# Altium schematic sheet 2021.SchDoc
size A4
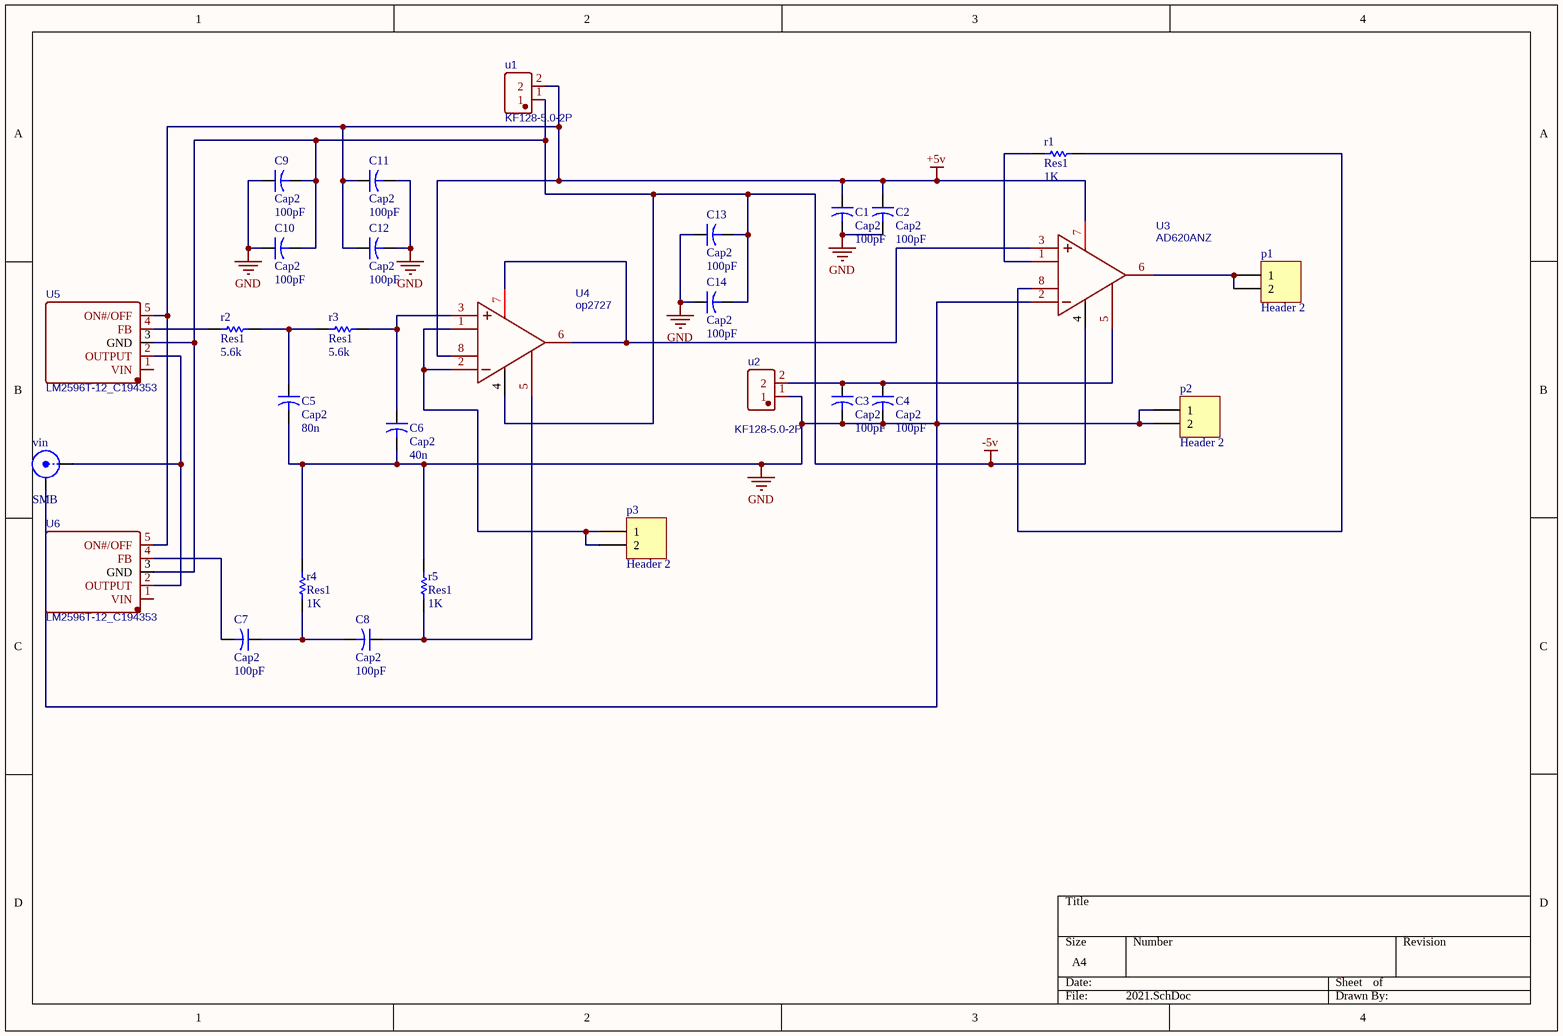
[diagram p0: 2021.SchDoc]

## Parts
C1  Cap2  value 100pF  [CAPR5-4X5]
C2  Cap2  value 100pF  [CAPR5-4X5]
C3  Cap2  value 100pF  [CAPR5-4X5]
C4  Cap2  value 100pF  [CAPR5-4X5]
C5  Cap2  value 80n  [CAPR5-4X5]
C6  Cap2  value 40n  [CAPR5-4X5]
C7  Cap2  value 100pF  [CAPR5-4X5]
C8  Cap2  value 100pF  [CAPR5-4X5]
C9  Cap2  value 100pF  [CAPR5-4X5]
C10  Cap2  value 100pF  [CAPR5-4X5]
C11  Cap2  value 100pF  [CAPR5-4X5]
C12  Cap2  value 100pF  [CAPR5-4X5]
C13  Cap2  value 100pF  [CAPR5-4X5]
C14  Cap2  value 100pF  [CAPR5-4X5]
p1  Header 2  [HDR1X2]
p2  Header 2  [HDR1X2]
p3  Header 2  [HDR1X2]
r1  Res1  value 1K  [AXIAL-0.3]
r2  Res1  value 5.6k  [AXIAL-0.3]
r3  Res1  value 5.6k  [AXIAL-0.3]
r4  Res1  value 1K  [AXIAL-0.3]
r5  Res1  value 1K  [AXIAL-0.3]
u1  KF128-5.0-2P  [CONN-TH_P5.00_KF128-5.0-2P]
u2  KF128-5.0-2P  [CONN-TH_P5.00_KF128-5.0-2P]
U3  AD620ANZ  [DIP-8_L9.3-W6.4-P2.54-LS7.6-BL]
U4  op2727  [DIP-8_L9.3-W6.4-P2.54-LS7.6-BL]
U5  LM2596T-12_C194353  [TO-220-5L_L10.2-W4.5-P1.71-L]
U6  LM2596T-12_C194353  [TO-220-5L_L10.2-W4.5-P1.71-L]
vin  SMB  [SMB_V-RJ45]

## Nets
+5v: C1.1 C2.1 C11.1 C12.1 u1.2 U3.7(+VS) U4.8(RG) U5.5(ON#/OFF) U6.5(ON#/OFF)
-5v: C9.2 C10.2 C13.2 C14.2 u1.1 U3.4(-VS) U4.4(-VS) U5.3(GND) U6.3(GND)
GND: C1.2 C2.2 C3.2 C4.2 C5.2 C6.2 C9.1 C10.1 C11.2 C12.2 C13.1 C14.1 p2.1 p2.2 r4.2 r5.2 u2.1 U3.2(-IN) vin.2(Y)
NetC3_1: C3.1 C4.1 u2.2 U3.5(REF)
NetC5_1: C5.1 r2.2 r3.1
NetC6_1: C6.1 r3.2 U4.3(+IN)
NetC7_1: C7.1 C8.2 r4.1
NetC7_2: C7.2 U6.4(FB)
NetC8_1: C8.1 r5.1 U4.5(REF)
Netp1_1: p1.1 p1.2 U3.6(OUTPUT)
Netp3_1: p3.1 p3.2 U4.1(RG) U4.2(-IN)
Netr1_1: r1.1 U3.1(RG)
Netr1_2: r1.2 U3.8(RG)
Netr2_1: r2.1 U5.4(FB)
NetU3_3: U3.3(+IN) U4.6(OUTPUT) U4.7(+VS)
NetU5_2: U5.2(OUTPUT) U6.2(OUTPUT) vin.1(X)

Not connected (* = marked no-connect by the designer): U5 1(VIN); U6 1(VIN)

## Library data of the parts
C1-C14 = Cap2: Capacitor; Published: 23-Sep-2002; PackageReference: CAPR5-4X5; Publisher: Altium Limited
p1-p3 = Header 2: Header, 2-Pin; LatestRevisionDate: 17-Jul-2002; LatestRevisionNote: Re-released for DXP Platform.; Publisher: Altium Limited
r1-r5 = Res1: Resistor; Published: 8-Jun-2000; LatestRevisionDate: 17-Jul-2002; LatestRevisionNote: Re-released for DXP Platform.; PackageReference: AXIAL-0.3; Publisher: Altium Limited
u1 u2 = KF128-5.0-2P: BOM_Manufacturer: Cixi Kefa Elec; Contributor: LCSC; BOM_Supplier: LCSC; BOM_Supplier Part: C474950; BOM_Manufacturer Part: KF128-5.0-2P; BOM_JLCPCB Part Class: Extended Part; spicePre: U; spiceSymbolName: KF128-5.0-2P
U3 U4 = AD620ANZ: BOM_Manufacturer: ADI; spicePre: X; BOM_Supplier: LCSC; BOM_Manufacturer Part: AD620ANZ; BOM_Supplier Part: C9680; BOM_JLCPCB Part Class: Extended Part; spiceSymbolName: AD620ANZ
U5 U6 = LM2596T-12_C194353: BOM_Manufacturer: HGSEMI; Contributor: LCSC; BOM_Supplier: LCSC; BOM_Supplier Part: C194353; BOM_Manufacturer Part: LM2596T-12; BOM_JLCPCB Part Class: Extended Part; spicePre: U; spiceSymbolName: LM2596T-12_C194353
vin = SMB: SMB Straight Connector; LatestRevisionDate: 17-Jul-2002; LatestRevisionNote: Re-released for DXP Platform.; Publisher: Altium Limited